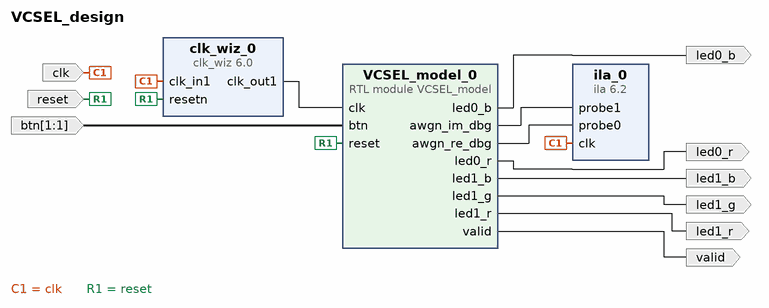
[diagram p0: block diagram of the top level]
# Vivado block design VCSEL_design, xc7z020clg484-1, Vivado 2024.2
create_bd_design VCSEL_design

create_bd_port -dir I -type rst reset
create_bd_port -dir I -type clk clk
create_bd_port -dir I -from 1 -to 1 btn
create_bd_port -dir O led1_r
create_bd_port -dir O led1_g
create_bd_port -dir O led1_b
create_bd_port -dir O led0_r
create_bd_port -dir O valid
create_bd_port -dir O led0_b

create_bd_cell -type module -reference VCSEL_model VCSEL_model_0
create_bd_cell -type ip -vlnv xilinx.com:ip:clk_wiz:6.0 clk_wiz_0
set_property -dict {CONFIG.RESET_PORT resetn CONFIG.RESET_TYPE ACTIVE_LOW CONFIG.USE_LOCKED false} [get_bd_cells clk_wiz_0]
create_bd_cell -type ip -vlnv xilinx.com:ip:ila:6.2 ila_0
set_property -dict [list \
  CONFIG.C_MONITOR_TYPE Native \
  CONFIG.C_NUM_OF_PROBES 2 \
  CONFIG.C_PROBE0_WIDTH 8 \
  CONFIG.C_PROBE1_WIDTH 8 \
] [get_bd_cells ila_0]

# ---- connections ----

connect_bd_net [get_bd_pins VCSEL_model_0/awgn_im_dbg] [get_bd_pins ila_0/probe1]
connect_bd_net [get_bd_pins VCSEL_model_0/awgn_re_dbg] [get_bd_pins ila_0/probe0]
connect_bd_net [get_bd_pins VCSEL_model_0/led0_b] [get_bd_ports led0_b]
connect_bd_net [get_bd_pins VCSEL_model_0/led0_r] [get_bd_ports led0_r]
connect_bd_net [get_bd_pins VCSEL_model_0/led1_b] [get_bd_ports led1_b]
connect_bd_net [get_bd_pins VCSEL_model_0/led1_g] [get_bd_ports led1_g]
connect_bd_net [get_bd_pins VCSEL_model_0/led1_r] [get_bd_ports led1_r]
connect_bd_net [get_bd_pins VCSEL_model_0/valid] [get_bd_ports valid]
connect_bd_net -net btn_0_1 [get_bd_ports btn] [get_bd_pins VCSEL_model_0/btn]
connect_bd_net -net clk_in1_0_1 [get_bd_ports clk] [get_bd_pins clk_wiz_0/clk_in1] [get_bd_pins ila_0/clk]
connect_bd_net [get_bd_pins clk_wiz_0/clk_out1] [get_bd_pins VCSEL_model_0/clk]
connect_bd_net -net resetn_0_1 [get_bd_ports reset] [get_bd_pins clk_wiz_0/resetn] [get_bd_pins VCSEL_model_0/reset]

validate_bd_design
save_bd_design
